# EAGLE design Smart_Lights_X4 (EAGLE 9.5.1)
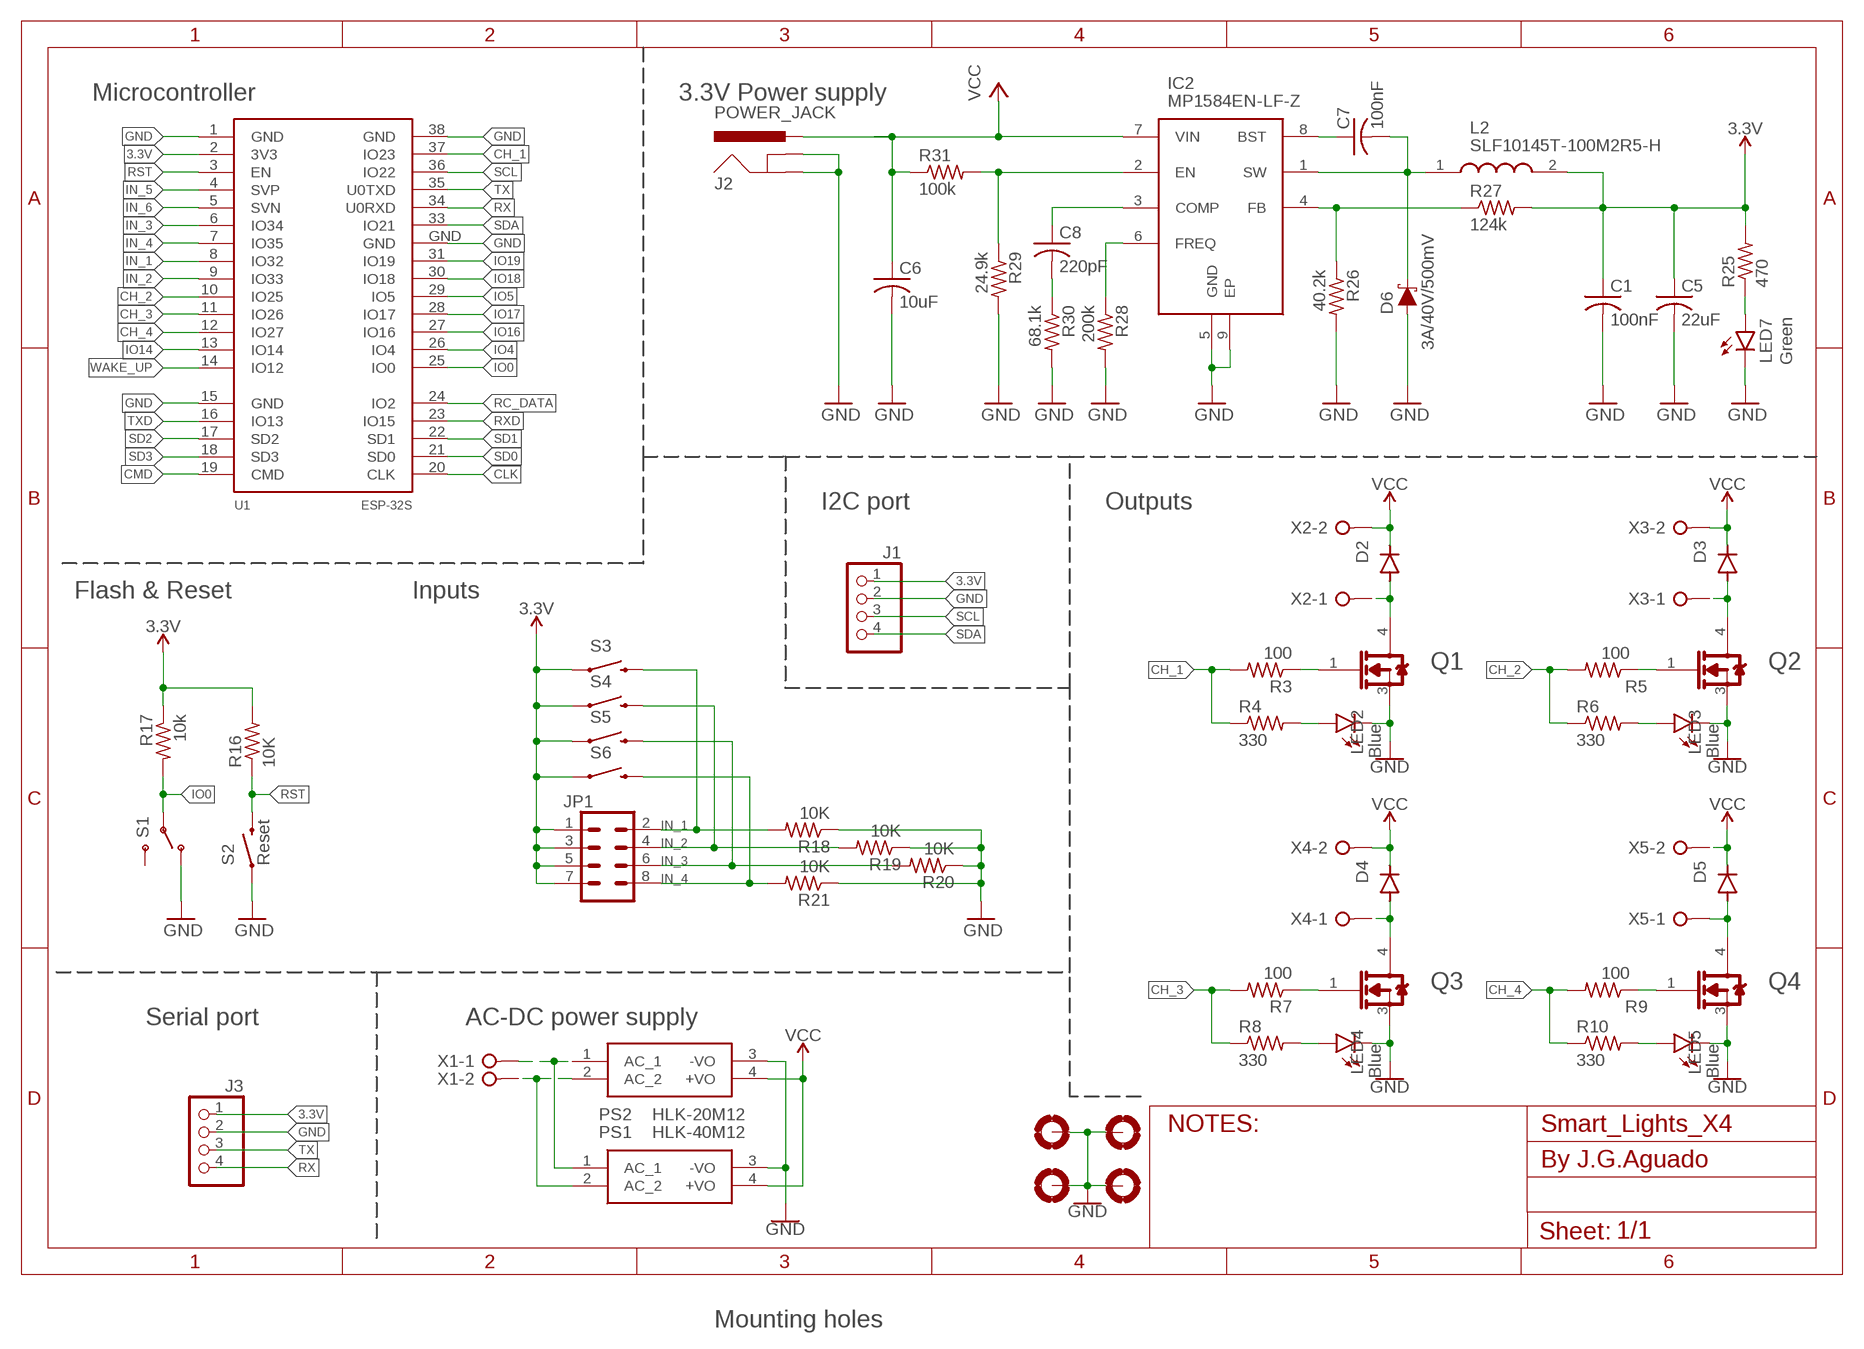
[diagram p0: schematic, sheet 1]

## Parts
C1  100nF  C-USC0603  [C0603]
C5  22uF  C-USC0603  [C0603]
C6  10uF  C-USC0603  [C0603]
C7  100nF  C-USC0603  [C0603]
C8  220pF  C-USC0603  [C0603]
D2  DIODE-SOD123  [SOD123]
D3  DIODE-SOD123  [SOD123]
D4  DIODE-SOD123  [SOD123]
D5  DIODE-SOD123  [SOD123]
D6  3A/40V/500mV  DIODE-SCHOTTKY-B340A  [SMA-DIODE]
FRAME1  A4L-LOC  [92X87]
IC2  MP1584EN-LF-Z  [SOIC127P600X170-9N]
J1  PINHD-1X4  [1X04]
J2  POWER_JACK  [POWER_JACK_PTH]
J3  PINHD-1X4  [1X04]
JP1  CONN_04X2  [2X4]
L2  SLF10145T-100M2R5-H  [SLF10145]
LED2  Blue  LEDSML0603  [SML0603]
LED3  Blue  LEDSML0603  [SML0603]
LED4  Blue  LEDSML0603  [SML0603]
LED5  Blue  LEDSML0603  [SML0603]
LED7  Green  LEDSML0603  [SML0603]
PS1  HLK-40M12  [HLK-40M12]
PS2  HLK-20M12  [HLK-20M12]
Q1  IRLR2905TRPBF  INFINEON_TECHNOLOGIES_IRLR2905TRPBFINFINEON_TECHNOLOGIES_IRLR2905TRPBF_0_0  [INFINEON_TECHNOLOGIES_IRLR2905TRPBF_0]
Q2  IRLR2905TRPBF  INFINEON_TECHNOLOGIES_IRLR2905TRPBFINFINEON_TECHNOLOGIES_IRLR2905TRPBF_0_0  [INFINEON_TECHNOLOGIES_IRLR2905TRPBF_0]
Q3  IRLR2905TRPBF  INFINEON_TECHNOLOGIES_IRLR2905TRPBFINFINEON_TECHNOLOGIES_IRLR2905TRPBF_0_0  [INFINEON_TECHNOLOGIES_IRLR2905TRPBF_0]
Q4  IRLR2905TRPBF  INFINEON_TECHNOLOGIES_IRLR2905TRPBFINFINEON_TECHNOLOGIES_IRLR2905TRPBF_0_0  [INFINEON_TECHNOLOGIES_IRLR2905TRPBF_0]
R3  100  R-US_R0603  [R0603]
R4  330  R-US_R0603  [R0603]
R5  100  R-US_R0603  [R0603]
R6  330  R-US_R0603  [R0603]
R7  100  R-US_R0603  [R0603]
R8  330  R-US_R0603  [R0603]
R9  100  R-US_R0603  [R0603]
R10  330  R-US_R0603  [R0603]
R16  10K  R-US_R0603  [R0603]
R17  10k  R-US_R0603  [R0603]
R18  10K  R-US_R0603  [R0603]
R19  10K  R-US_R0603  [R0603]
R20  10K  R-US_R0603  [R0603]
R21  10K  R-US_R0603  [R0603]
R25  470  R-US_R0603  [R0603]
R26  40.2k  R-US_R0603  [R0603]
R27  124k  R-US_R0603  [R0603]
R28  200k  R-US_R0603  [R0603]
R29  24.9k  R-US_R0603  [R0603]
R30  68.1k  R-US_R0603  [R0603]
R31  100k  R-US_R0603  [R0603]
S1  SWITCH_SPDT  [KPS-1290]
S2  Reset  SWITCH-MOMENTARY-2SMD-4  [TACTILE_SWITCH_TALL]
S3  Reset  SWITCH-MOMENTARY-2SMD-4  [TACTILE_SWITCH_TALL]
S4  Reset  SWITCH-MOMENTARY-2SMD-4  [TACTILE_SWITCH_TALL]
S5  Reset  SWITCH-MOMENTARY-2SMD-4  [TACTILE_SWITCH_TALL]
S6  Reset  SWITCH-MOMENTARY-2SMD-4  [TACTILE_SWITCH_TALL]
U1  ESP-32S  [ESP-32S]
X1  W237-02P  [W237-132]
X2  W237-02P  [W237-132]
X3  W237-02P  [W237-132]
X4  W237-02P  [W237-132]
X5  W237-02P  [W237-132]

## Nets
3.3V: C1.1 C5.1 J1.1 J3.1 JP1.1 JP1.3 JP1.5 JP1.7 L2.2 R16.2 R17.1 R25.2 R27.2 S3.A2 S4.A2 S5.A2 S6.A2 U1.2(3V3)
CH_1: R3.2 R4.1 U1.37(IO23)
CH_2: R5.2 R6.1 U1.10(IO25)
CH_3: R7.2 R8.1 U1.11(IO26)
CH_4: R9.2 R10.1 U1.12(IO27)
CLK: U1.20(CLK)
CMD: U1.19(CMD)
GND: C1.2 C5.2 C6.2 D6.A FRAME1.B3,1(MOUNT) FRAME1.B3,2(MOUNT1) FRAME1.B3,3(MOUNT2) FRAME1.B3,6(MOUNT3) IC2.5(GND) IC2.9(EP) J1.2 J2.GND J2.GNDBREAK J3.2 LED2.C LED3.C LED4.C LED5.C LED7.C PS1.3(-VO) PS2.3(-VO) Q1.3(SOURCE) Q2.3(SOURCE) Q3.3(SOURCE) Q4.3(SOURCE) R18.1 R19.1 R20.1 R21.1 R26.2 R28.2 R29.2 R30.2 S1.O S2.A2 U1.1(GND) U1.15(GND) U1.38(GND) U1.GND
IN_1: JP1.2 R18.2 S3.B2 U1.8(IO32)
IN_2: JP1.4 R19.2 S4.B2 U1.9(IO33)
IN_3: JP1.6 R20.2 S5.B2 U1.6(IO34)
IN_4: JP1.8 R21.2 S6.B2 U1.7(IO35)
IN_5: U1.4(SVP)
IN_6: U1.5(SVN)
IO0: R17.2 S1.P U1.25(IO0)
IO4: U1.26(IO4)
IO5: U1.29(IO5)
IO14: U1.13(IO14)
IO16: U1.27(IO16)
IO17: U1.28(IO17)
IO18: U1.30(IO18)
IO19: U1.31(IO19)
N$1: Q2.1(GATE) R5.1
N$2: PS1.1(AC_1) PS2.1(AC_1) X1.1
N$3: PS1.2(AC_2) PS2.2(AC_2) X1.2
N$4: D2.A Q1.4(DRAIN) X2.1
N$5: Q1.1(GATE) R3.1
N$6: D3.A Q2.4(DRAIN) X3.1
N$7: Q3.1(GATE) R7.1
N$8: D4.A Q3.4(DRAIN) X4.1
N$9: Q4.1(GATE) R9.1
N$10: D5.A Q4.4(DRAIN) X5.1
N$16: LED4.A R8.2
N$17: LED2.A R4.2
N$18: LED3.A R6.2
N$19: LED5.A R10.2
N$27: LED7.A R25.1
N$28: C7.1 IC2.8(BST)
N$29: C7.2 D6.C IC2.1(SW) L2.1
N$30: IC2.4(FB) R26.1 R27.1
N$31: C8.2 R30.1
N$32: C8.1 IC2.3(COMP)
N$33: IC2.6(FREQ) R28.1
N$34: IC2.2(EN) R29.1 R31.2
RC_DATA: U1.24(IO2)
RST: R16.1 S2.B2 U1.3(EN)
RX: J3.4 U1.34(U0RXD)
RXD: U1.23(IO15)
SCL: J1.3 U1.36(IO22)
SD0: U1.21(SD0)
SD1: U1.22(SD1)
SD2: U1.17(SD2)
SD3: U1.18(SD3)
SDA: J1.4 U1.33(IO21)
TX: J3.3 U1.35(U0TXD)
TXD: U1.16(IO13)
VCC: C6.1 D2.C D3.C D4.C D5.C IC2.7(VIN) J2.PWR PS1.4(+VO) PS2.4(+VO) R31.1 X2.2 X3.2 X4.2 X5.2
WAKE_UP: U1.14(IO12)
Unconnected: S1.S

## Notes on the sheet
- Microcontroller | 3.3V Power supply
- I2C port | Outputs
- Flash & Reset | Inputs
- Serial port | AC-DC power supply
- Mounting holes

## Library data of the parts
C1 C5-C8 = rcl:C-US: CAPACITOR, American symbol; SPICEPREFIX: C
D2-D5 = diode:DIODE-: DIODE
D6 = SparkFun-DiscreteSemi:DIODE-SCHOTTKY: Schottky diode A Schottky diode is a semiconductor diode which has a low forward voltage drop and a very fast switching action.; PROD_ID: DIO-09886
FRAME1 = SpaceDIY_symbols:A4L-LOC: FRAME DIN A4, landscape with location and doc. field
IC2 = SamacSys_Parts:MP1584EN-LF-Z: Switching Voltage Regulators 3A 1.5MHz 28V Nonsync Buck Source: Datasheet <https://componentsearchengine.com/Datasheets/1/MP1584EN-LF-Z.pdf>; DESCRIPTION: Switching Voltage Regulators 3A 1.5MHz 28V Nonsync Buck; HEIGHT: 1.7mm; MANUFACTURER_NAME: Monolithic Power Systems (MPS); MANUFACTURER_PART_NUMBER: MP1584EN-LF-Z; MOUSER_PART_NUMBER: 946-MP1584ENLFZ; MOUSER_PRICE-STOCK: https://www.mouser.co.uk/ProductDetail/Monolithic-Power-Systems-MPS/MP1584EN-LF-Z?qs=rC7bBWoQAAktQUA%2FYI26vA%3D%3D
J1 J3 = pinhead:PINHD-1X4: PIN HEADER
J2 = SparkFun-Connectors:POWER_JACK: Power Jack Connector This is the standard 5.5mm barrel jack for power. The PTH is the most common, proven, reliable, footprint. The Slot footprint only works if the mill layer is transmitted to the PCB fab house so be warned. Here are the connectors we sell at SparkFun: DC Barrel Power Jack/Connector <https://www.sparkfun.com/products/119> (PRT-00119) DC Barrel Power Jack/Connector (SMD) <https://www.sparkfun.com/products/12748> (PRT-12748) DC Barrel Jack Adapter - Breadboard Compatible <https://www.sparkfun.com/products/10811> (PRT-10811) It is used on this SparkFun product (and many, many others): SparkFun RedBoard - Programmed with Arduino <https://www.sparkfun.com/products/12757> (DEV-12757) Also, if you need a mating power supply or connector, please check these out: Wall Adapter Power Supply - 9VDC 650mA <https://www.sparkfun.com/products/298> (TOL-00298) DC Barrel Jack Adapter - Male <https://www.sparkfun.com/products/10287> (PRT-10287); PROD_ID: CONN-08197
JP1 = SparkFun-Connectors:CONN_04X2: Multi connection point. Often used as Generic Header-pin footprint for 0.1 inch spaced/style header connections On any of the 0.1 inch spaced packages, you can populate with these: Break Away Headers - Straight <https://www.sparkfun.com/products/116> (PRT-00116) Break Away Male Headers - Right Angle <https://www.sparkfun.com/products/553> (PRT-00553) Female Headers <https://www.sparkfun.com/products/115> (PRT-00115) Break Away Headers - Machine Pin <https://www.sparkfun.com/products/117> (PRT-00117) Break Away Female Headers - Swiss Machine Pin <https://www.sparkfun.com/products/743> (PRT-00743)
L2 = SamacSys_Parts:SLF10145T-100M2R5-H: Inductors for power circuits, Wound ferrite, Automotive Source: Datasheet <https://product.tdk.com/system/files/dam/doc/product/inductor/inductor/smd/catalog/inductor_automotive_power_slf10145-h_en.pdf>; DESCRIPTION: Inductors for power circuits, Wound ferrite, Automotive; HEIGHT: mm; MANUFACTURER_NAME: TDK; MANUFACTURER_PART_NUMBER: SLF10145T-100M2R5-H; MOUSER_PART_NUMBER: 810-SLF10145T100M2R5; MOUSER_PRICE-STOCK: https://www.mouser.co.uk/ProductDetail/TDK/SLF10145T-100M2R5-H?qs=Ydpp5fRLlSHtCO7lbZYIxA%3D%3D
LED2-LED5 LED7 = led:LED: LED OSRAM: - CHIPLED LG R971, LG N971, LY N971, LG Q971, LY Q971, LO R971, LY R971 LH N974, LH R974 LS Q976, LO Q976, LY Q976 LO Q996 - Hyper CHIPLED LW Q18S LB Q993, LB Q99A, LB R99A - SideLED LS A670, LO A670, LY A670, LG A670, LP A670 LB A673, LV A673, LT A673, LW A673 LH A674 LY A675 LS A676, LA A676, LO A676, LY A676, LW A676 LS A679, LY A679, LG A679 - Hyper Micro SIDELED® LS Y876, LA Y876, LO Y876, LY Y876 LT Y87S - SmartLED LW L88C, LW L88S LB L89C, LB L89S, LG L890 LS L89K, LO L89K, LY L89K LS L896, LA L896, LO L896, LY L896 - TOPLED LS T670, LO T670, LY T670, LG T670, LP T670 LSG T670, LSP T670, LSY T670, LOP T670, LYG T670 LG T671, LOG T671, LSG T671 LB T673, LV T673, LT T673, LW T673 LH T674 LS T676, LA T676, LO T676, LY T676, LB T676, LH T676, LSB T676, LW T676 LB T67C, LV T67C, LT T67C, LS T67K, LO T67K, LY T67K, LW E67C LS E67B, LA E67B, LO E67B, LY E67B, LB E67C, LV E67C, LT E67C LW T67C LS T679, LY T679, LG T679 LS T770, LO T770, LY T770, LG T770, LP T770 LB T773, LV T773, LT T773, LW T773 LH T774 LS E675, LA E675, LY E675, LS T675 LS T776, LA T776, LO T776, LY T776, LB T776 LHGB T686 LT T68C, LB T68C - Hyper Mini TOPLED® LB M676 - Mini TOPLED Santana® LG M470 LS M47K, LO M47K, LY M47K Source: http://www.osram.convergy.de LUXEON: - LUMILED® LXK2-PW12-R00, LXK2-PW12-S00, LXK2-PW14-U00, LXK2-PW14-V00 LXK2-PM12-R00, LXK2-PM12-S00, LXK2-PM14-U00 LXK2-PE12-Q00, LXK2-PE12-R00, LXK2-PE12-S00, LXK2-PE14-T00, LXK2-PE14-U00 LXK2-PB12-K00, LXK2-PB12-L00, LXK2-PB12-M00, LXK2-PB14-N00, LXK2-PB14-P00, LXK2-PB14-Q00 LXK2-PR12-L00, LXK2-PR12-M00, LXK2-PR14-Q00, LXK2-PR14-R00 LXK2-PD12-Q00, LXK2-PD12-R00, LXK2-PD12-S00 LXK2-PH12-R00, LXK2-PH12-S00 LXK2-PL12-P00, LXK2-PL12-Q00, LXK2-PL12-R00 Source: www.luxeon.com KINGBRIGHT: KA-3528ASYC Source: www.kingbright.com
PS1 = SpaceDIY_boards:HLK-40M12: 20W Series of Ultra-compact Power Module Source: Datasheet <https://www.rhydolabz.com/documents/30/HLK-20M12.pdf>
PS2 = SpaceDIY_boards:HLK-20M12: 20W Series of Ultra-compact Power Module Source: Datasheet <https://www.rhydolabz.com/documents/30/HLK-20M12.pdf>
Q1-Q4 = Infineon Technologies - IRLR2905TRPBF:INFINEON_TECHNOLOGIES_IRLR2905TRPBF: MOSFET N-CH 55V 42A DPAK; AUTOMOTIVE: No; CENTROID_NOT_SPECIFIED: Yes; CONTINUOUS_DRAIN_CURRENT: 42A; DATASHEET: https://www.infineon.com/dgdl/irlr2905pbf.pdf?fileId=5546d462533600a40153566cc2bb2679; DEPLETION_MODE: False; DEVICE_CLASS_L1: Discrete Semiconductors; DEVICE_CLASS_L2: Transistors; DEVICE_CLASS_L3: MOSFETs; DIGIKEY_DESCRIPTION: TRANS MOSFET N-CH 55V 42A DPAK; DIGIKEY_PART_NUMBER: IRLR2905PBFCT-ND; DRAIN_TO_SOURCE_BREAKDOWN_VOLTAGE: 55V; DRAIN_TO_SOURCE_RESISTANCE: 0.03Ω; DRAIN_TO_SOURCE_VOLTAGE: 55V; FOOTPRINT_URL: http://www.irf.com/package/hexfet/dpakfootprint.pdf; FOOTPRINT_VARIANT_NAME_0: Recommended_Land_Pattern; GATE_CHARGE_AT_VGS: 48nC @ 5V; GATE_TO_SOURCE_VOLTAGE: 16V; HEIGHT: 2.52mm; INPUT_CAPACITACE_AT_VDS: 1700pF @ 25V; LEAD_FREE: Yes; MAX_FORWARD_DIODE_VOLTAGE: 1.3V; MAX_JUNCTION_TEMP: +175°C; MF: Infineon Technologies; MFG_PACKAGE_IDENT: PG-TO252-3; MFG_PACKAGE_IDENT_DATE: 0; MFG_PACKAGE_IDENT_REV: 901; MOUSER_PART_NUMBER: 942-IRLR2905TRPBF; MPN: IRLR2905TRPBF; NUMBER_OF_CHANNELS: 1; NUMBER_OF_N_CHANNELS: 1; PACKAGE: D-Pak; POWER_DISSIPATION: 110W; PREFIX: Q; PULSE_DRAIN_CURRENT: 160A; REVERSE_RECOVERY_CHARGE: 210nC; REVERSE_RECOVERY_TIME: 80ns; ROHS: Yes; RTHJA_MAX: 110°C/W; TEMPERATURE_RANGE_HIGH: +175°C; TEMPERATURE_RANGE_LOW: -55°C; THRESHOLD_VGS_MAX: 2V; THRESHOLD_VGS_MIN: 1V; TURN_OFF_DELAY_TIME: 26ns; TURN_ON_DELAY_TIME: 11ns; VERIFICATION_VERSION: 0.0.0.3
R3-R10 R16-R21 R25-R31 = rcl:R-US_: RESISTOR, American symbol; SPICEPREFIX: R
S1 = SparkFun-Retired:SWITCH_SPDT: SWCH-10651 Side-actuated SPDT slide switch, as used on the Arduino Pro; PROD_ID: SWCH-10651
S2-S6 = Testing:SWITCH-MOMENTARY-2: Various NO switches- pushbuttons, reed, etc
U1 = esp32:ESP-32S: Ai-Thinker ESP-32S
X1-X5 = con-wago-508:W237-02P: WAGO SREW CLAMP; OC_FARNELL: unknown; OC_NEWARK: unknown

## Net classes
0 default: clearance 0.205 mm
2 analog: width 0.203 mm, drill 0.33 mm, clearance 0.152 mm

## Board
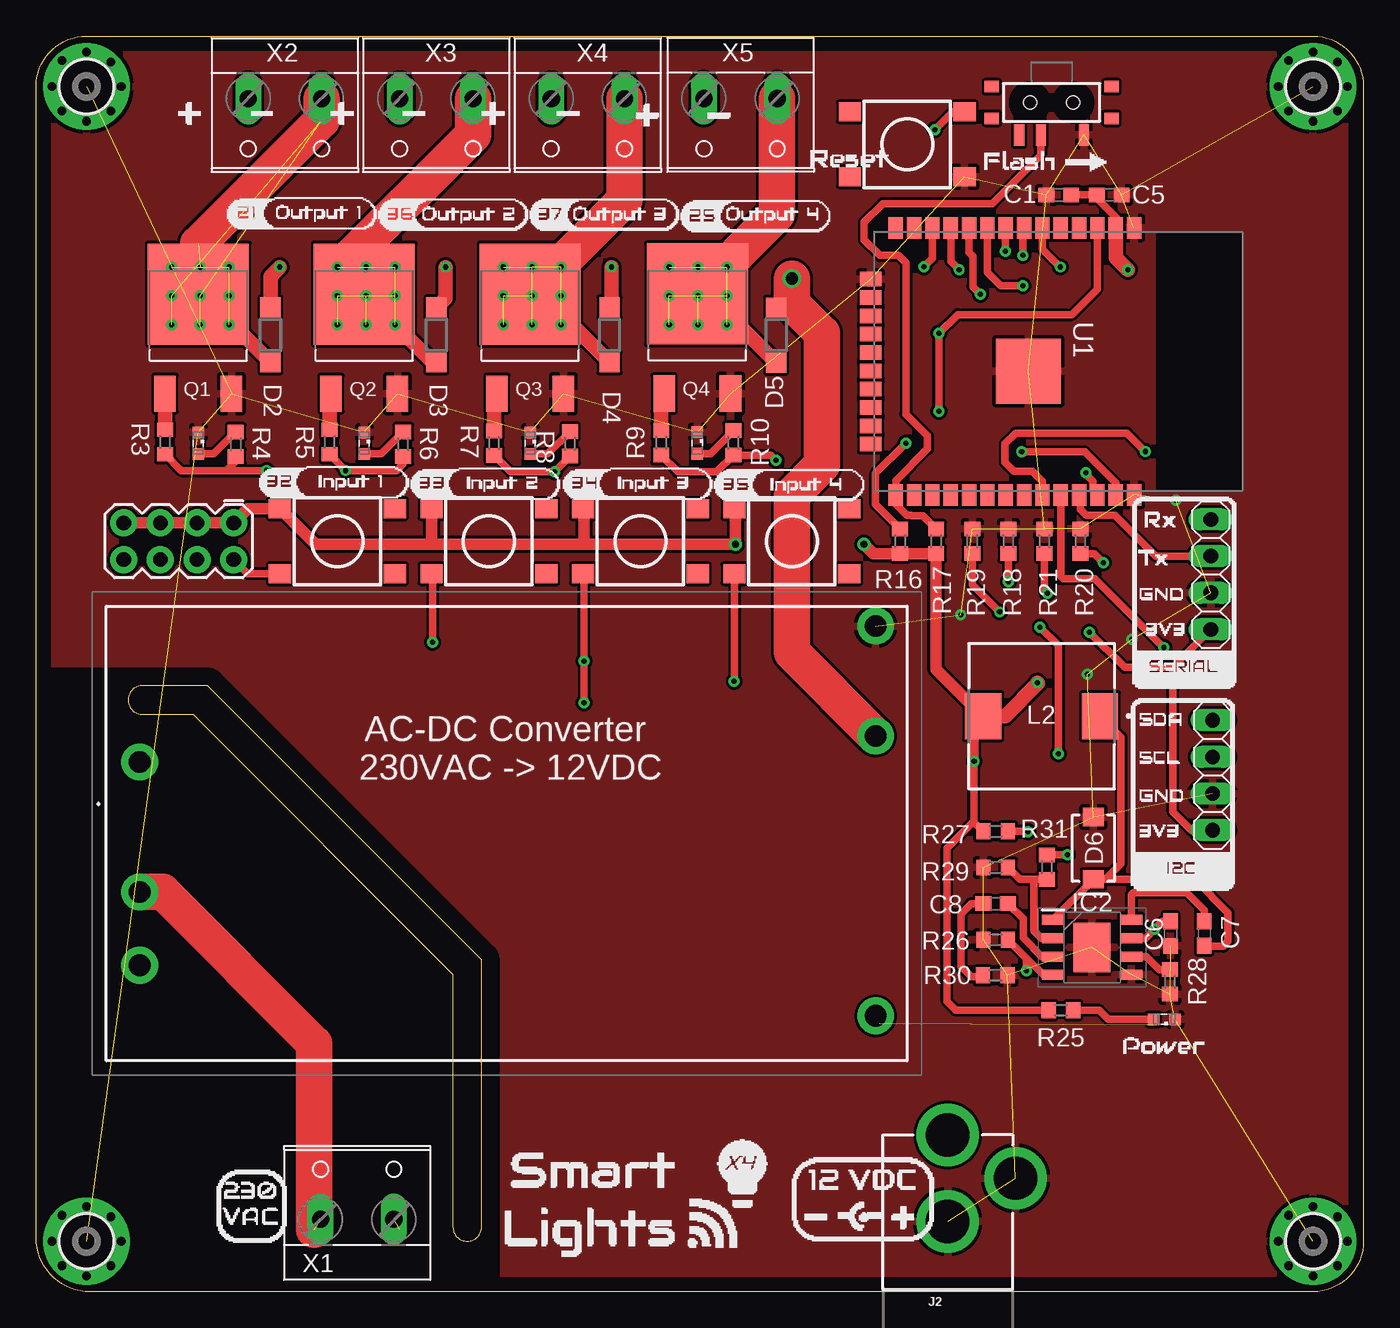
[diagram p1: board, top side]
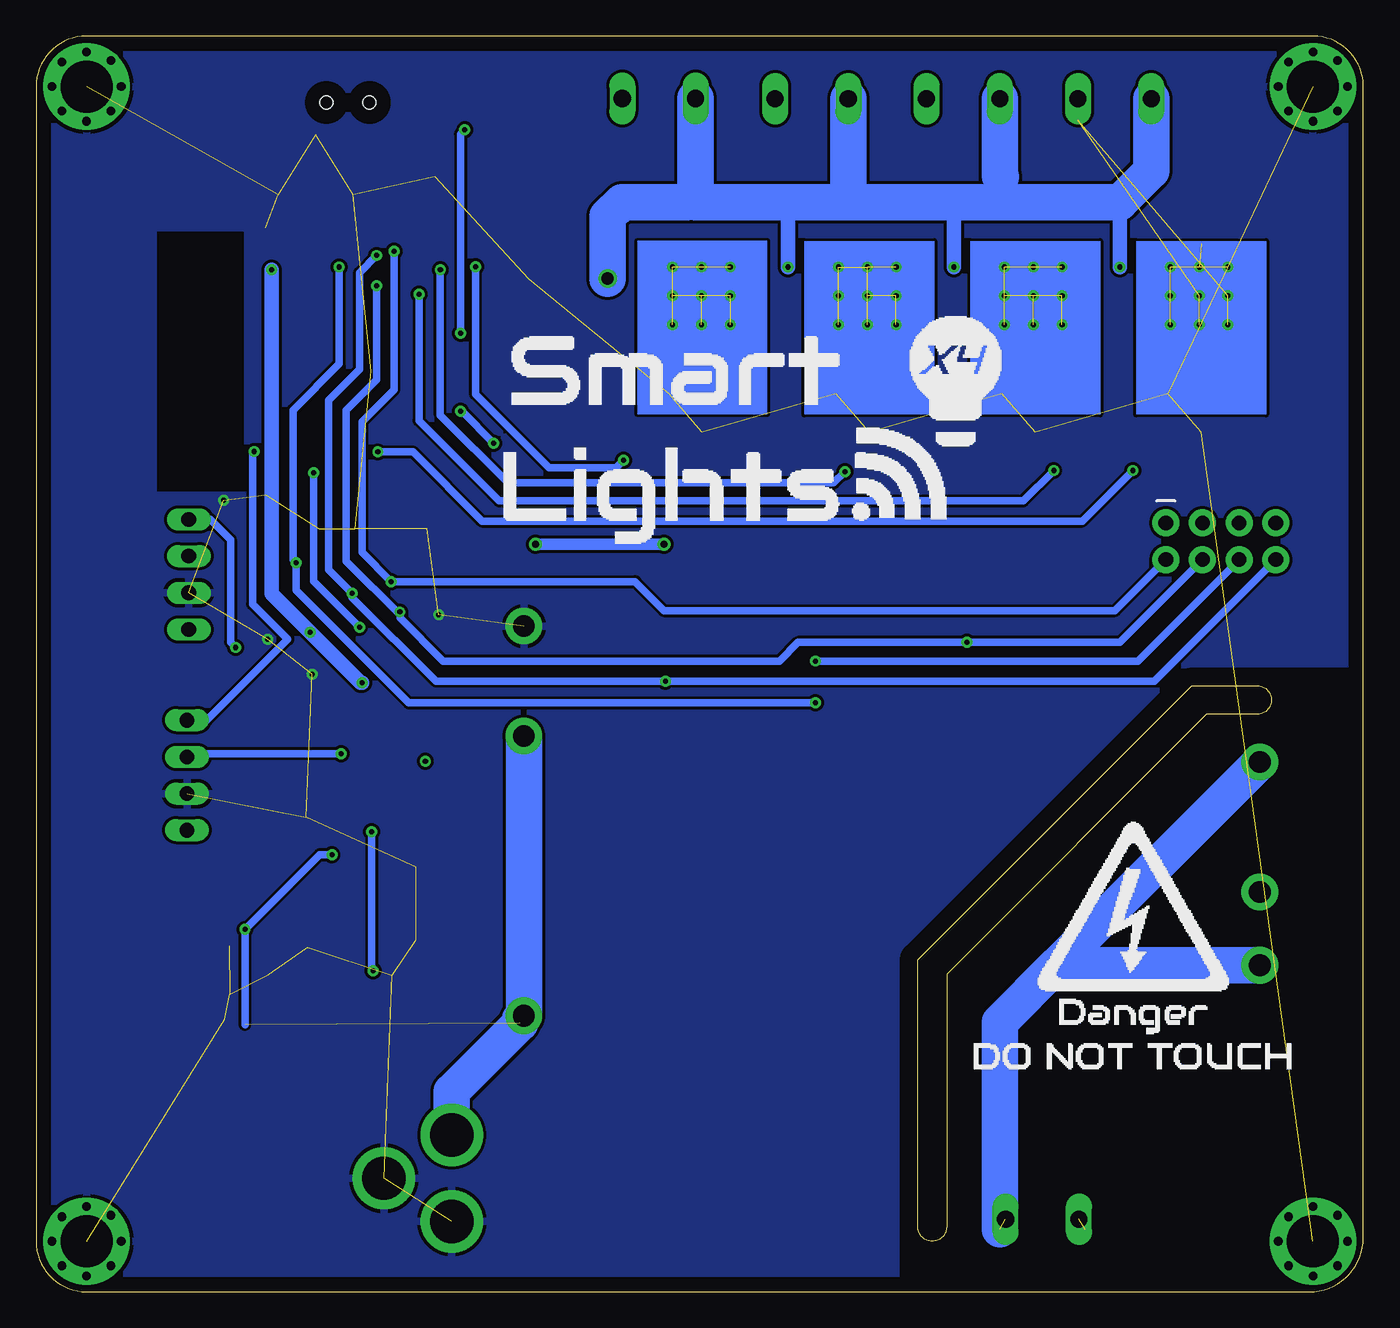
[diagram p2: board, bottom side, seen from below]

Size 92 x 87 mm. Coordinates in mm from the lower left corner, seen from the top.
Outline: 7.39,42 arc90 6.39,41 arc90 7.39,40 10.89,40 28.89,22 28.89,4.5 arc90 29.89,3.5 arc90 30.89,4.5 30.89,23 11.89,42 7.39,42
Copper layers (1*16): Top 0.035mm / dielectric 1.5mm / Bottom 0.035mm
Design rules "default": minimum track width 6mil, minimum drill 0.35mm, track to track 6mil, track to pad 6mil, pad to pad 6mil, via to via 6mil, smd to smd 6mil, copper to edge 40mil, drill to drill 6mil, minimum pad ring 10mil, minimum via ring 8mil, stop-mask expansion 4mil, vias tented up to drill 0mil, thermal gap 10mil
tRestrict: area -0.1,0 to 30.9,42
bRestrict: area -0.1,0 to 30.9,42

### Footprints (pad centres in the part's own frame; a part is rotated, then mirrored left to right if it is on the bottom)
C0603 = smd 1.1 x 1: 1 -0.85,0; 2 0.85,0
SOD123 = smd 1.4 x 1.4: A 1.9,0; C -1.9,0
SMA-DIODE = smd 1.27 x 1.47: A -2.15,0; C 2.15,0
92X87 = drill 3.6 pad 6: B3,1 3.5,83.5; B3,2 88.5,83.5; B3,3 88.5,3.5; B3,6 3.5,3.5 | drill 0.6 pad 0.61: P$1 3.5,5.9; P$2 1.1,3.5; P$3 3.5,1.1; P$4 5.9,3.5; P$5 1.8,5.3; P$6 5.2,5.2; P$7 5.2,1.8; P$8 1.8,1.8; P$9 3.5,85.9; P$10 1.1,83.5; P$11 3.5,81.1; P$12 5.9,83.5; P$13 1.8,85.3; P$14 5.2,85.2; P$15 5.2,81.8; P$16 1.8,81.8; P$17 88.5,85.9; P$18 86.1,83.5; P$19 88.5,81.1; P$20 90.9,83.5; P$21 86.8,85.3; P$22 90.2,85.2; P$23 90.2,81.8; P$24 86.8,81.8; P$25 88.5,5.9; P$26 86.1,3.5; P$27 88.5,1.1; P$28 90.9,3.5; P$29 86.8,5.3; P$30 90.2,5.2; P$31 90.2,1.8; P$32 86.8,1.8
SOIC127P600X170-9N = smd 1.525 x 0.7: 1 -2.712,1.905; 2 -2.712,0.635; 3 -2.712,-0.635; 4 -2.712,-1.905; 5 2.712,-1.905; 6 2.712,-0.635; 7 2.712,0.635; 8 2.712,1.905 | smd 2.56 x 3.45: 9 0,0
1X04 = drill 1.016 long: 1 -3.81,0; 2 -1.27,0; 3 1.27,0; 4 3.81,0
POWER_JACK_PTH = drill 2.997 pad 4.318: GND 0,7.7; GNDBREAK 4.7,10.7; PWR 0,13.7
2X4 = drill 1.016 pad 1.88: 1 -3.81,-1.27; 2 -3.81,1.27; 3 -1.27,-1.27; 4 -1.27,1.27; 5 1.27,-1.27; 6 1.27,1.27; 7 3.81,-1.27; 8 3.81,1.27
SLF10145 = smd 2.5 x 3.2: 1 -4.05,0; 2 4.05,0
SML0603 = smd 0.8 x 0.8: A 0.75,0; C -0.75,0
HLK-40M12 = drill 1.5 pad 2.54: 1 3.3,12.7; 2 3.3,7.62; 3 54.3,31.12; 4 54.3,23.5
HLK-20M12 = drill 1.5 pad 2.54: 1 3.3,12.7; 2 3.3,21.7; 3 54.3,31.12; 4 54.3,4.12
INFINEON_TECHNOLOGIES_IRLR2905TRPBF_0 = smd 1.5 x 2.5: 1 -2.3,-4.575; 3 2.3,-4.575 | smd 7 x 7: 4 0,2.325
R0603 = smd 1 x 1.1: 1 -0.85,0; 2 0.85,0
KPS-1290 = smd 0.7 x 1.5: O -2.25,2.25; P 0.75,2.25; S 2.25,2.25 | smd 1 x 0.8: P$1 -4.15,1.1; P$2 -4.15,-1.1; P$3 4.15,-1.1; P$4 4.15,1.1 | hole 0.9: -1.5,0; 1.5,0
TACTILE_SWITCH_TALL = smd 1.55 x 1.3: A1 -3.975,-2.25; A2 3.975,-2.25; B1 -3.975,2.25; B2 3.975,2.25
ESP-32S = smd 1.5 x 1: 1 -9.25,7; 2 -9.25,5.73; 3 -9.25,4.46; 4 -9.25,3.19; 5 -9.25,1.92; 6 -9.25,0.65; 7 -9.25,-0.62; 8 -9.25,-1.89; 9 -9.25,-3.16; 10 -9.25,-4.43; 11 -9.25,-5.7; 12 -9.25,-6.97; 13 -9.25,-8.24; 14 -9.25,-9.51; 25 9.25,-9.51; 26 9.25,-8.24; 27 9.25,-6.97; 28 9.25,-5.7; 29 9.25,-4.43; 30 9.25,-3.16; 31 9.25,-1.89; 32 9.25,-0.62; 33 9.25,0.65; 34 9.25,1.92; 35 9.25,3.19; 36 9.25,4.46; 37 9.25,5.73; 38 9.25,7 | smd 1 x 1.5: 15 -5.7,-11.25; 16 -4.43,-11.25; 17 -3.16,-11.25; 18 -1.89,-11.25; 19 -0.62,-11.25; 20 0.65,-11.25; 21 1.92,-11.25; 22 3.19,-11.25; 23 4.46,-11.25; 24 5.73,-11.25 | smd 4.5 x 4.5: GND 0.68,-0.33
W237-132 = drill 1.194 long: 1 -2.54,-0.635; 2 2.54,-0.635

### Placement (x,y rotation side)
C1  70.89,76 180 top
C5  74.39,76 0 top
C6  78.63,24.81 270 top
C7  80.96,24.82 270 top
C8  66.51,26.9 180 top
D2  16.24,66.3 270 top
D3  27.74,66.3 270 top
D4  39.74,66.3 270 top
D5  51.3,66.28 270 top
D6  73.28,30.73 270 top
FRAME1  0,0 0 top
IC2  73.19,23.86 0 top
J1  81.54,35.79 90 top
J2  63.19,-2.83 0 top
J3  81.42,49.7 90 top
JP1  9.89,52 180 top
L2  69.69,39.88 180 top
LED2  11.24,58.8 270 top
LED3  22.74,58.8 270 top
LED4  34.24,58.8 270 top
LED5  45.83,58.81 270 top
LED7  78.19,18.88 180 top
PS1  3.89,15 0 top
PS2  3.89,15 0 top
Q1  11.24,66.8 0 top
Q2  22.74,66.8 0 top
Q3  34.24,66.8 0 top
Q4  45.83,66.81 0 top
R3  8.94,58.88 270 top
R4  13.84,58.72 90 top
R5  20.34,58.88 270 top
R6  25.44,58.72 90 top
R7  31.74,58.8 270 top
R8  37.01,58.75 90 top
R9  43.33,58.81 270 top
R10  48.33,58.81 90 top
R16  59.89,52 270 top
R17  62.39,52 90 top
R18  67.39,52 270 top
R19  64.89,52 270 top
R20  72.39,52 270 top
R21  69.89,52 270 top
R25  71.03,19.51 180 top
R26  66.51,24.4 180 top
R27  66.51,31.9 180 top
R28  78.58,21.47 270 top
R29  66.51,29.4 180 top
R30  66.48,21.92 0 top
R31  70.06,29.42 270 top
S1  70.39,82.4 180 top
S2  60.39,79.5 0 top
S3  20.89,52 180 top
S4  31.39,52 180 top
S5  41.89,52 180 top
S6  52.39,52 180 top
U1  69.1,64.46 270 top
X1  22.26,5.65 0 top
X2  17.24,82.03 180 top
X3  27.74,82.03 180 top
X4  38.24,82.03 180 top
X5  48.83,82.04 180 top

### Tracks (layer width: path | path; a pad name or v marks a point on that pad's centre or on a via)
3.3V  (via drill 0.35, 0.5)
  Top 0.508: C1.1 C5.1 73.54,75.75 74.89,74.4 74.89,73.77 U1.2 | R27.2 65.02,32.53 65.02,32.61 | 65.02,32.61 v65.02,36.76 | R25.2 63.75,19.51 63.13,20.13 63.13,30.73 65.02,32.61 | 78.79,43.26 78.79,33.25 80.06,31.98 J1.1 | J3.1 78.79,43.26 | 78.79,43.26 75.45,43.26 v73.01,45.7
  Top 0.61: L2.2 65.02,39.26 v65.02,36.76
  Top 0.813: L2.2 62.39,43.13 R17.1 R16.2 58.04,51.15 v57.39,51.8 | 37.99,51.8 v48.49,51.8 48.49,54.17 S6.A2 | 37.99,51.8 27.39,51.8 | S4.A2 27.41,51.83 27.39,51.8 | JP1.7 JP1.5 JP1.3 JP1.1 14.68,54.25 S3.A2 19.36,51.8 27.39,51.8 | S5.A2 37.99,54.17 37.99,51.8
  Top 1.016: v69.41,42.2 69.45,42.16 67.17,39.88 L2.2 | v75.69,70.8 74.83,71.66 U1.2
  Bottom 0.813: v48.49,51.8 v57.39,51.8
  Bottom 1.016: v69.41,42.2 69.51,42.2 v73.01,45.7 75.69,48.37 v75.69,70.8
CH_1  (via drill 0.35)
  Top 0.508: R3.2 10.07,56.9 13.19,56.9 | 13.19,56.9 13.84,57.56 R4.1 | 13.19,56.9 v15.99,56.9 | v68.31,58.19 72.69,58.19 74.83,56.05 U1.37
  Top 0.61: 68.37,58.12 v68.31,58.19
  Bottom 0.508: v15.99,56.9 19.49,53.4 61.09,53.4 65.88,58.19 v68.31,58.19
CH_2  (via drill 0.35)
  Top 0.508: R5.2 v21.47,56.9 24.99,56.9 25.44,57.36 R6.1 | U1.10 64.67,72.03 64.93,71.76 64.93,69.64 v65.46,69.11
  Bottom 0.508: v21.47,56.9 23.57,54.8 59.91,54.8 65.46,60.35 v65.46,69.11
CH_3  (via drill 0.35)
  Top 0.508: R7.2 32.89,56.8 35.91,56.8 v35.94,56.83 R8.1 | v63.98,70.81 63.4,71.39 U1.11
  Bottom 0.508: v35.94,56.83 36.73,56.04 59.27,56.04 63.98,60.74 v63.98,70.81
CH_4  (via drill 0.35)
  Top 0.508: R9.2 44.49,56.8 47.17,56.8 R10.1 50.92,57.96 v51.29,57.6 | v61.55,71.02 62.13,71.6 U1.12
  Bottom 0.508: v51.29,57.6 51.79,57.1 56.45,57.1 61.55,62.2 v61.55,71.02
GND  (via drill 0.35)  (41 unrouted)
  other vias: 64.09,46.9 79,54.83 72.87,42.77 75.94,45.2
  pour Top: 3.39,87 arc90 -0.11,83.5 -0.11,5 arc90 4.89,0 88.39,0 arc90 91.89,3.5 91.89,83.5 arc90 88.39,87
  pour Bottom: 3.39,87 arc90 -0.11,83.5 -0.11,5 arc90 4.89,0 88.39,0 arc90 91.89,3.5 91.89,83.5 arc90 88.39,87
IN_1  (via drill 0.35)
  Top 0.508: R18.2 v67.39,49.2 | S3.B2 14.68,49.75 JP1.2 | v67.19,72.1 67.19,73.69 U1.8
  Bottom 0.508: JP1.2 17.23,47.2 48.49,47.2 50.49,49.2 v67.39,49.2 69.41,51.23 69.41,60.27 67.19,62.5 v67.19,72.1
IN_2  (via drill 0.35)
  Top 0.508: v66.79,47.1 64.89,49 R19.2 | S4.B2 27.49,49.67 v27.49,45 | U1.9 65.94,70.65 66.89,69.7 v68.39,69.7
  Bottom 0.508: JP1.4 16.89,45 v27.49,45 39.19,45 40.49,43.7 63.79,43.7 66.79,46.7 66.79,46.9 | 66.79,46.9 v66.79,47.1 | v68.39,69.7 68.39,63.2 70.51,61.08 70.51,50.62 66.79,46.9
IN_3  (via drill 0.35)
  Top 0.508: S5.B2 37.99,49.67 v37.99,43.7 v37.99,40.8 | U1.6 69.75,72.24 v70.99,71 | R20.2 73.34,51.15 v73.99,50.5
  Bottom 0.508: v37.99,40.8 66.17,40.8 73.99,48.61 v73.99,50.5 74.2,50.71 74.2,61.09 70.99,64.3 v70.99,71 | JP1.6 15.65,43.7 v37.99,43.7
IN_4  (via drill 0.35)
  Top 0.508: v70.09,48.4 69.89,48.6 R21.2 | S6.B2 48.41,42.33 v48.39,42.3 | v68.39,71.8 68.39,73.62 U1.7
  Bottom 0.508: JP1.8 14.51,42.3 v48.39,42.3 64.29,42.3 70.09,48.1 v70.09,48.4 71.72,50.03 71.72,61.77 69.59,63.9 69.59,70.6 v68.39,71.8
IO0
  Top 0.508: R17.2 61.46,53.77 60.66,53.77 60.63,53.81 60.36,53.81 59.59,54.58 U1.25 59.59,56.2 61.79,58.4 61.79,59.3 60.29,60.8 60.29,71.3 59.79,71.8 58.49,71.8 57.39,72.9 57.39,74.1 58.69,75.4 66.29,75.4 69.64,78.75 S1.P
N$1
  Top 1.016: R5.1 20.34,62.12 Q2.1
N$2  (1 unrouted)
  Top 2.54: PS1.1 8.79,27.7 19.29,17.2 19.29,4.3
N$3  (1 unrouted)
  Bottom 2.54: 25.2,4.32 25.2,18.68 21.27,22.62 | 21.27,22.62 PS2.2 | PS1.2 21.27,22.62
N$4  (via drill 0.35)  (9 unrouted)
  Top 1.016: D2.A 11.52,69.12 Q1.4
  Top 2.54: Q1.4 11.24,72.62 19.78,81.16 X2.1
  other vias: 9.39,71 11.39,71 13.39,71 9.39,69 11.39,69 13.39,69 9.39,67 11.39,67 13.39,67
N$5
  Top 1.016: R3.1 Q1.1
N$6
  Top 1.016: D3.A 27.47,64.4 Q2.4
  Top 2.54: Q2.4 21.24,70.62 20.74,70.62 30.28,80.16 X3.1
N$7
  Top 1.016: R7.1 31.74,62.02 Q3.1
N$8
  Top 1.016: D4.A 35.02,69.12 Q3.4
  Top 2.54: Q3.4 40.78,75.66 X4.1
N$9
  Top 1.016: R9.1 43.33,62.04 Q4.1
N$10
  Top 1.016: D5.A 46.55,69.14 Q4.4
  Top 2.54: Q4.4 51.37,74.68 X5.1
N$11  (via drill 0.35)  (8 unrouted)
  other vias: 20.89,71 22.89,71 24.89,71 20.89,69 22.89,69 24.89,69 20.89,67 22.89,67 24.89,67
N$12  (via drill 0.35)  (8 unrouted)
  other vias: 32.39,71 34.39,71 36.39,71 32.39,69 34.39,69 36.39,69 32.39,67 34.39,67 36.39,67
N$13  (via drill 0.35)  (8 unrouted)
  other vias: 43.89,71 45.89,71 47.89,71 43.89,69 45.89,69 47.89,69 43.89,67 45.89,67 47.89,67
N$16
  Top 0.508: LED4.A 35.46,58.05 R8.2
N$17
  Top 0.508: LED2.A 12.32,58.05 R4.2
N$18
  Top 0.508: LED3.A 23.92,58.05 R6.2
N$19
  Top 0.508: LED5.A 46.73,58.06 R10.2
N$27
  Top 0.508: LED7.A 74.33,18.88 73.7,19.51 R25.1
N$28
  Top 0.508: C7.1 80.96,26.43 79.74,27.64 76.04,27.64 75.9,27.5 IC2.8
N$29
  Top 0.508: L2.1 75.19,38.42 75.19,29.65 74.13,28.58 D6.C | IC2.1 73.28,28.56 D6.C | D6.C 80.3,28.58 82.62,26.27 82.62,24.27 82.28,23.94 80.99,23.94 C7.2
N$30  (via drill 0.35)
  Top 0.508: R26.1 68.65,23.11 | 68.65,23.11 69.8,21.95 IC2.4 | R27.1 68.72,31.9 v68.74,31.87 | v68.64,22.25 68.64,23.09 68.65,23.11
  Bottom 0.508: v68.74,31.87 68.74,22.35 v68.64,22.25
N$31
  Top 0.508: C8.2 64.82,26.9 64.09,26.16 64.09,22.56 64.83,21.82 65.52,21.82 R30.1
N$32
  Top 0.508: IC2.3 69.72,23.22 68.42,24.52 68.42,25.83 C8.1
N$33
  Top 0.508: IC2.6 76.97,23.22 77.87,22.32 R28.1
N$34
  Top 0.508: R29.1 68.19,28.57 69.16,28.57 | 69.16,28.57 R31.2 | 69.16,28.57 69.16,25 69.67,24.49 IC2.2
RST  (via drill 0.35)
  Top 0.508: R16.1 58.19,54.55 58.19,56.7 v60.29,58.8 | v62.59,61 v62.59,66.4 63.89,67.7 71.79,67.7 73.56,69.47 U1.3 | S2.B2 63.54,81.75 v62.29,80.5
  Bottom 0.508: v62.29,80.5 62.59,80.2 v62.59,66.4 | v60.29,58.8 62.49,61 v62.59,61
RX  (via drill 0.35)
  Top 0.508: v78.16,44.64 73.4,49.4 71.19,49.4 71.02,49.57 U1.34
  Bottom 0.508: J3.4 79.92,53.51 78.53,52.11 78.53,45 v78.16,44.64
SCL  (via drill 0.35)
  Top 0.508: U1.36 73.25,55.52 73.25,56.15 72.76,56.63 v72.76,56.74 | v69.59,46.05 70.86,44.78 v70.86,37.27
  Bottom 0.508: v72.76,56.74 72.76,49.22 v69.59,46.05 | v70.86,37.27 81.33,37.27 J1.3
SDA  (via drill 0.35)
  Top 0.508: v76.89,58.22 75.62,59.49 67.89,59.49 67.15,58.75 67.15,57.48 67.79,56.84 69.06,56.84 69.75,56.15 U1.33
  Bottom 0.508: J1.4 80.17,39.6 74.56,45.2 76.99,47.64 76.99,58.11 v76.89,58.22
TX
  Top 0.508: U1.35 72.39,55.11 72.39,54.22 72.79,53.81 73.13,53.81 73.13,53.8 74.79,53.8 77.62,50.97 J3.3
VCC  (via drill 0.35, 0.85)  (1 unrouted)
  Top 0.508: C6.1 78.08,25.66 v77.52,25.1 76.91,24.49 IC2.7 | R31.1 71.47,30.27 v71.49,30.29
  Top 1.016: D5.C 52.07,68.18 52.39,68.5 | D4.C 39.89,68.34 v39.89,71 | D3.C 28.39,68.84 v28.39,71 | D2.C 16.24,70.36 v16.89,71
  Top 2.54: PS1.4 52.39,44.3 52.39,55.2 54.49,57.3 54.49,66.4 52.39,68.5 v52.39,70.2
  Bottom 0.508: 77.52,18.5 v77.52,25.1 72.34,30.29 v71.49,30.29 | 25.14,77.25 26.89,75.5 28.89,75.5
  Bottom 1.016: v39.89,71 39.89,75.5 | v16.89,71 16.89,75.5 | 28.89,75.5 28.39,75 v28.39,71
  Bottom 2.54: PS1.4 PS2.4 58.44,18.87 58.44,18.62 63.19,13.87 J2.PWR | 46.89,75.5 51.39,75.5 52.39,74.5 v52.39,70.2 | 36.89,75.5 28.89,75.5 16.89,75.5 14.7,77.68 X2.2 | 25.14,77.25 25.2,77.32 X3.2 | X4.2 35.7,75.5 39.89,75.5 46.29,75.5 X5.2
(copper drawn outside any net)
  shapes: Bottom area x4

### Text on the board
tNames: AC-DC Converter / 230VAC -> 12VDC